# EAGLE design LB_BIT_i18_MOTIONTRIGGER-v03(rev1) (EAGLE 6.6.0)
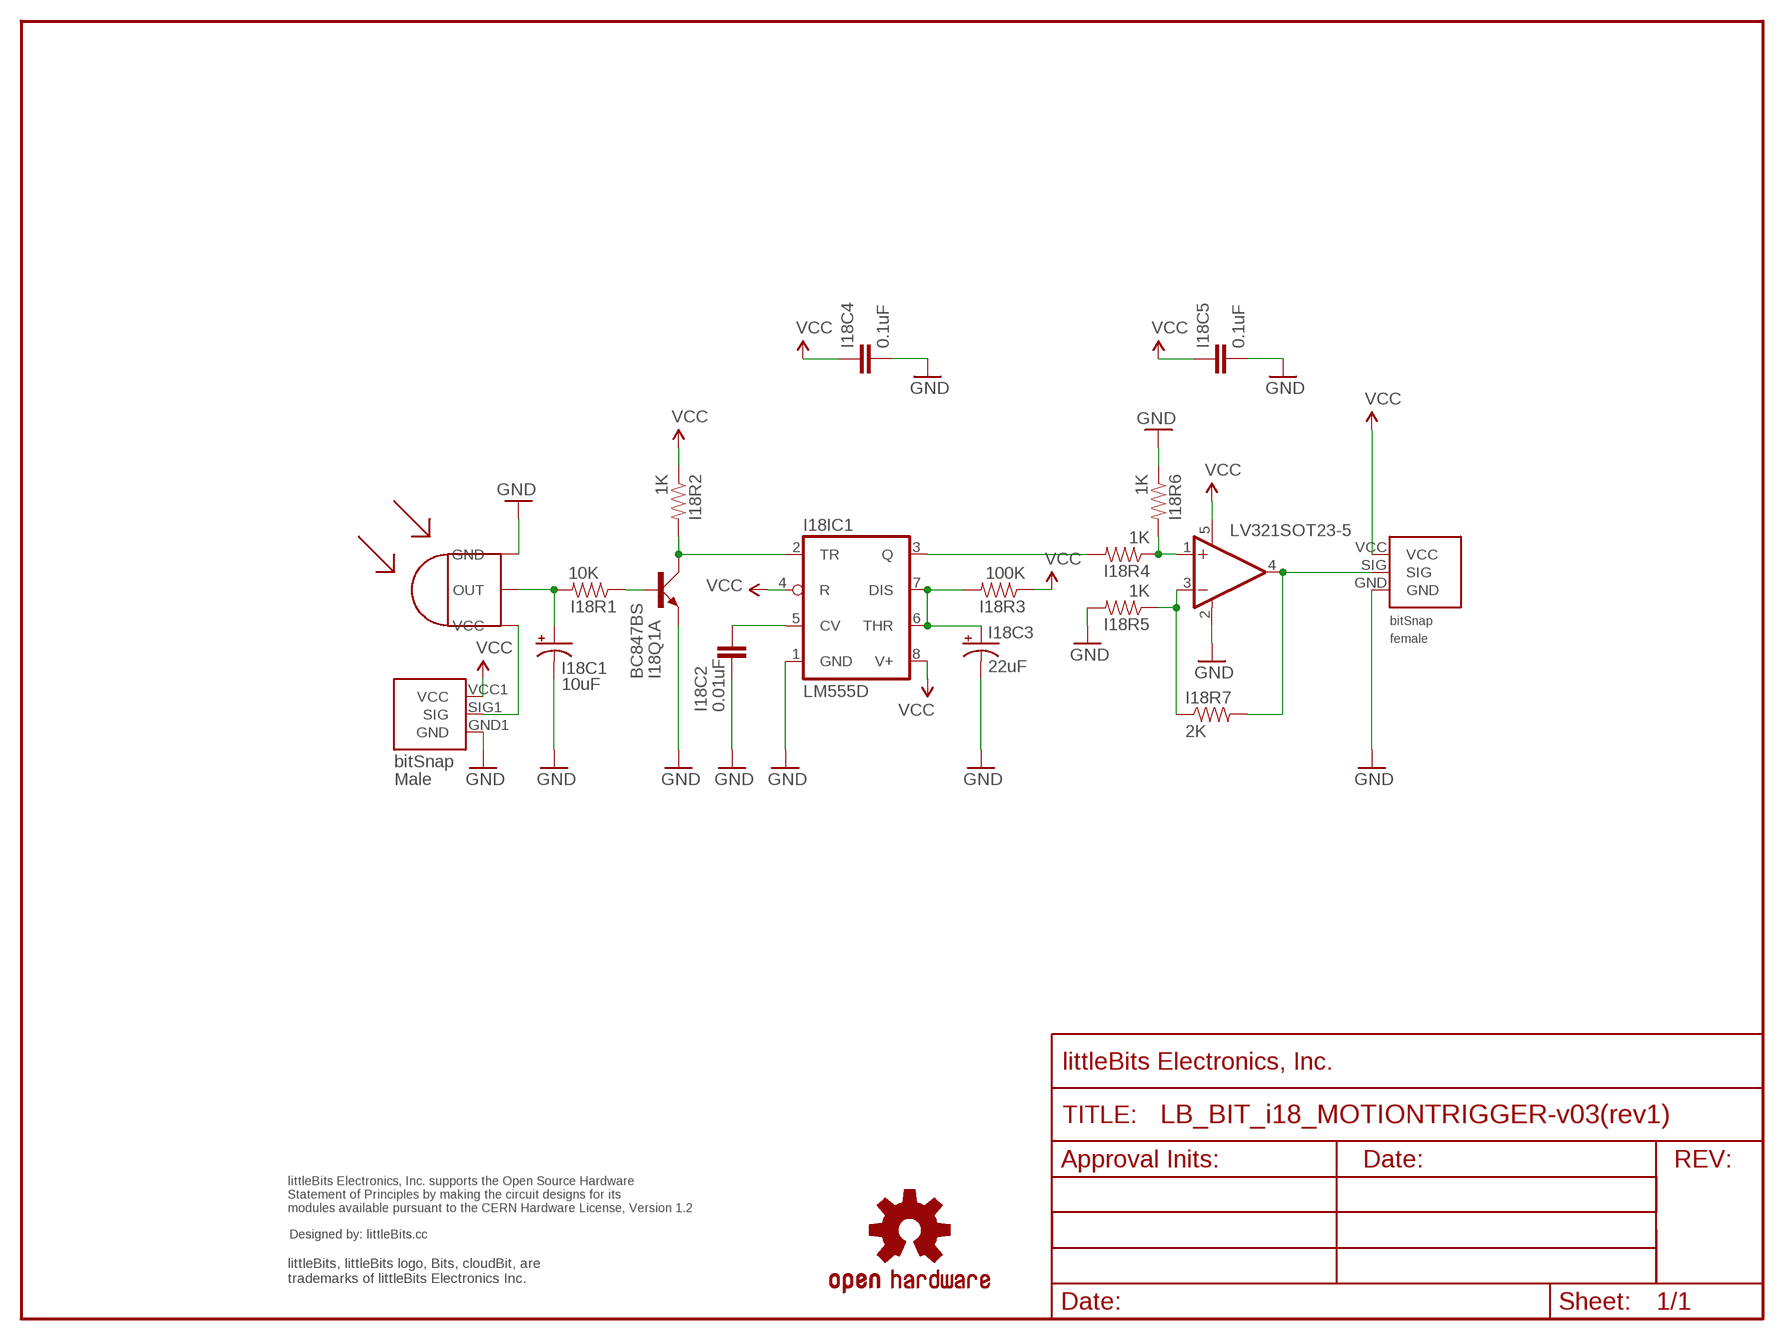
[diagram p0: schematic, sheet 1]

## Parts
I18BSF  BITSNAP_V03_FEMALE  [BITSNAP_V03_FEMALE]
I18BSM  BITSNAP_V03_MALE  [BITSNAP_V03_MALE]
I18C1  10uF  CAP_POL1206  [EIA3216]
I18C2  0.01uF  CAP0603-CAP  [0603-CAP]
I18C3  22uF  CAP_POL1206  [EIA3216]
I18C4  0.1uF  CAP0603-CAP  [0603-CAP]
I18C5  0.1uF  CAP0603-CAP  [0603-CAP]
I18IC1  LM555D  [SO08]
I18Q1  BC847BS  [SOT363_PHILIPS]
I18R1  10K  RESISTOR0603-RES  [0603-RES]
I18R2  1K  RESISTOR0603-RES  [0603-RES]
I18R3  100K  RESISTOR0603-RES  [0603-RES]
I18R4  1K  RESISTOR0603-RES  [0603-RES]
I18R5  1K  RESISTOR0603-RES  [0603-RES]
I18R6  1K  RESISTOR0603-RES  [0603-RES]
I18R7  2K  RESISTOR0603-RES  [0603-RES]
I18U1  PIR-EKMC1601112  [PIR-EKMC1601112]
I18U2  LV321SOT23-5  [SOT23-5]
U$1  OSHWCREDIT  [OSHWCREDIT]
U$2  FRAME-LETTER-OHWOHW  [FABDWG01-OHW]
U$8  OSHW-LOGOL  [OSHW-LOGO-L]

## Nets
GND: I18BSF.GND I18BSM.GND1(GND) I18C1.C(-) I18C2.2 I18C3.C(-) I18C4.2 I18C5.2 I18IC1.1(GND) I18Q1.1(A:E) I18R5.2 I18R6.1 I18U1.GND I18U2.2(V-)
N$1: I18BSM.SIG1(SIG) I18U1.VCC
N$2: I18IC1.2(TR) I18Q1.6(A:C) I18R2.2
N$3: I18C1.A(+) I18R1.2 I18U1.OUT
N$4: I18Q1.2(A:B) I18R1.1
N$5: I18C2.1 I18IC1.5(CV)
N$6: I18C3.A(+) I18IC1.6(THR) I18IC1.7(DIS) I18R3.2
N$7: I18IC1.3(Q) I18R4.2
N$8: I18R4.1 I18R6.2 I18U2.1(+IN)
N$9: I18R5.1 I18R7.1 I18U2.3(-IN)
N$10: I18BSF.SIG I18R7.2 I18U2.4(OUT)
VCC: I18BSF.VCC I18BSM.VCC1(VCC) I18C4.1 I18C5.1 I18IC1.4(R) I18IC1.8(V+) I18R2.1 I18R3.1 I18U2.5(V+)
Unconnected: I18Q1.3(B:C) I18Q1.4(B:E) I18Q1.5(B:B)

## Library data of the parts
I18BSF = bitSnap:BITSNAP_V03_FEMALE
I18BSM = bitSnap:BITSNAP_V03_MALE
I18C1 I18C3 = SparkFun:CAP_POL: Capacitor Polarized These are standard SMD and PTH capacitors. Normally 10uF, 47uF, and 100uF in electrolytic and tantalum varieties. Always verify the external diameter of the through hole cap, it varies with capacity, voltage, and manufacturer. The EIA devices should be standard.
I18C2 I18C4 I18C5 = SparkFun:CAP: Capacitor Standard 0603 ceramic capacitor, and 0.1" leaded capacitor.
I18IC1 = linear:*555: TIMER
I18Q1 = transistor-small-signal:BC847BS: NPN general purpose double transistor Source: http://www.farnell.com/datasheets/2466.pdf
I18R1-I18R7 = SparkFun:RESISTOR: Resistor Basic schematic elements and footprints for 0603, 1206, and PTH 1/10th watt (small) resistors.
I18U1 = LITTLEBITS:PIR-EKMC1601112
I18U2 = LITTLEBITS:LV321
U$1 = LITTLEBITS:OSHWCREDIT
U$2 = LITTLEBITS:FRAME-LETTER-OHW
U$8 = SparkFun_NEW:OSHW-LOGO: Open Source Hardware Logo This logo indicates the piece of hardware it is found on incorporates a OSHW license and/or adheres to the definition of open source hardware found here: http://freedomdefined.org/OSHW

## Board
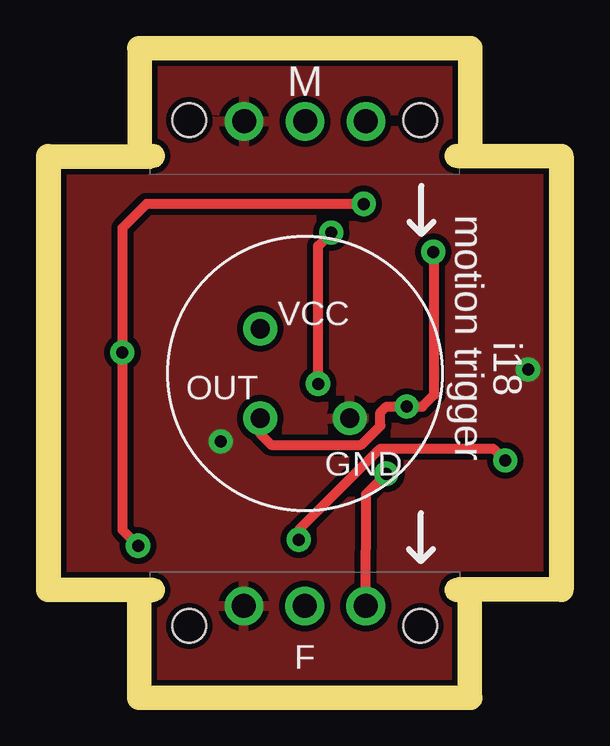
[diagram p1: board, top side]
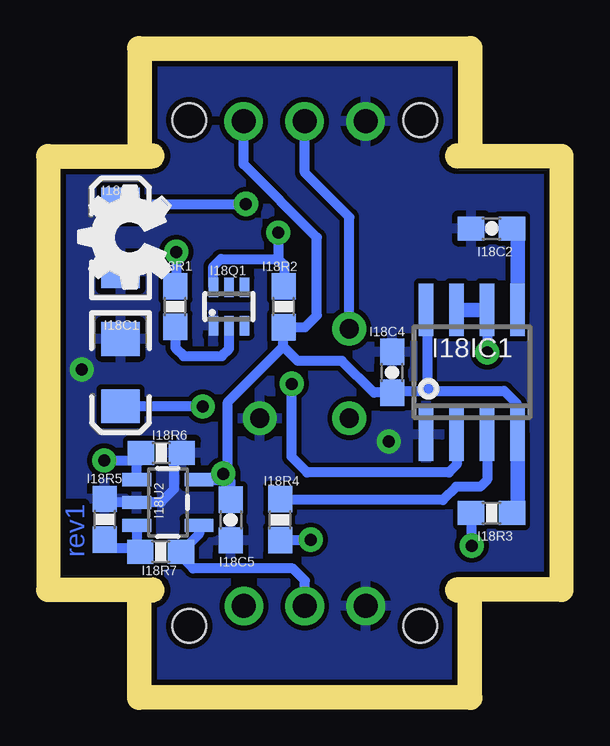
[diagram p2: board, bottom side, seen from below]

Size 20.4 x 26.1 mm. Coordinates in mm from the lower left corner, seen from the top.
Outline: 0,21.6 0,4.5
Outline: 20.4,4.5 20.4,21.6
Copper layers (1*16): Top 0.035mm / dielectric 1.5mm / Bottom 0.035mm
Design rules "default": minimum track width 8mil, minimum drill 20mil, track to track 8mil, track to pad 8mil, pad to pad 8mil, via to via 8mil, smd to smd 8mil, copper to edge 10mil, drill to drill 8mil, minimum pad ring 12mil, minimum via ring 10mil, stop-mask expansion 4mil, vias tented up to drill 25mil, thermal gap 10mil
Milling: 2 lines

### Footprints (pad centres in the part's own frame; a part is rotated, then mirrored left to right if it is on the bottom)
BITSNAP_V03_FEMALE = drill 1: GND 3.91,3.33; SIG 6.45,3.33; VCC 8.99,3.33 | hole 1.4: 1.63,2.5; 11.27,2.5
BITSNAP_V03_MALE = drill 1: GND1 8.98,2.56; SIG1 6.44,2.56; VCC1 3.9,2.56 | hole 1.4: 11.27,2.5; 1.63,2.5
EIA3216 = smd 1.4 x 1.6: A 1.4,0; C -1.4,0
0603-CAP = smd 1.1 x 1: 1 -0.85,0; 2 0.85,0
SO08 = smd 0.6 x 2.2: 1 -1.905,-2.6; 2 -0.635,-2.6; 3 0.635,-2.6; 4 1.905,-2.6; 5 1.905,2.6; 6 0.635,2.6; 7 -0.635,2.6; 8 -1.905,2.6
SOT363_PHILIPS = smd 0.4 x 0.8: 1 -0.65,-0.8; 2 0,-0.8; 3 0.65,-0.8; 4 0.65,0.8; 5 0,0.8; 6 -0.65,0.8
0603-RES = smd 1.1 x 1: 1 -0.85,0; 2 0.85,0
PIR-EKMC1601112 = drill 0.8: GND 1.865,-1.865; OUT -1.865,-1.865; VCC -1.865,1.865
SOT23-5 = smd 0.55 x 1.2: 1 -0.95,-1.3; 2 0,-1.3; 3 0.95,-1.3; 4 0.95,1.3; 5 -0.95,1.3

### Placement (x,y rotation side)
I18BSF  3.75,0 0 top
I18BSM  16.65,26.1 180 top
I18C1  17.88,13.06 270 bottom
I18C2  2.42,19.07 180 bottom
I18C3  17.88,18.68 90 bottom
I18C4  6.56,13.08 90 bottom
I18C5  13.29,6.92 270 bottom
I18IC1  3.24,13.08 0 bottom
I18Q1  13.36,15.82 0 bottom
I18R1  15.59,15.82 90 bottom
I18R2  11.08,15.81 90 bottom
I18R3  2.42,7.21 180 bottom
I18R4  11.23,6.93 90 bottom
I18R5  18.53,6.95 90 bottom
I18R6  16.18,9.72 180 bottom
I18R7  16.21,5.59 0 bottom
I18U1  10.21,13.03 0 top
I18U2  15.91,7.65 270 bottom
U$1  -94.3,-64.7 0 top  (outside the outline)
U$2  0,0 0 top
U$7  [OSHW_FILLX150_NOTEXT]  15.81,15.76 0 top
U$8  -32.8,-69.56 0 top  (outside the outline)

### Tracks (layer width: path | path; a pad name or v marks a point on that pad's centre or on a via)
GND  (via drill 0.5)
  Bottom 0.406: I18R5.2 18.38,7.65 I18U2.2 16.2,7.65 15.65,8.2 15.65,9.45 15.38,9.72 I18R6.1
  other vias: 6.7,10.2 19.5,13.2
  pour Top (isolate 0.254): 0.22,25.85 20.15,25.85 20.15,0.22 0.22,0.22
  pour Bottom: 0.22,25.85 20.15,25.85 20.15,0.22 0.22,0.22
N$1
  Bottom 0.406: I18U1.VCC 8.35,19.55 10.2,21.4 I18BSM.SIG1
N$2  (via drill 0.5)
  Top 0.406: v10.75,12.6 10.75,18.35 v11.3,18.9
  Bottom 0.406: I18Q1.6 14.01,17.49 13.7,17.8 11.3,17.8 | 11.3,17.8 11.05,17.55 11.05,16.69 I18R2.2 | I18IC1.2 3.87,9.23 4.2,8.9 10.1,8.9 10.75,9.55 v10.75,12.6 | v11.3,18.9 11.3,17.8
N$3  (via drill 0.5)
  Top 0.406: I18U1.OUT 8.35,10.51 8.8,10.05 12.55,10.05 13.35,10.85 13.35,11.4 13.6,11.65 v14.45,11.65 15.1,11.65 15.6,12.15 15.6,18.05 v15.55,18.1
  Bottom 0.406: v14.45,11.65 17.86,11.65 I18C1.A | v15.55,18.1 15.55,16.71 I18R1.2
N$4
  Bottom 0.406: I18R1.1 15.59,14.09 15.25,13.75 13.65,13.75 13.35,14.05 13.36,14.06 I18Q1.2
N$5
  Bottom 0.61: I18IC1.5 1.33,18.59 I18C2.1
N$6  (via drill 0.5)
  Top 0.406: v3.25,5.85 2.6,6.5 v2.6,13.9 2.6,19.1 3.6,20.1 v12.65,20.1
  Bottom 0.406: I18IC1.6 v2.6,13.9 | v3.25,5.85 3.25,7.19 I18R3.2 | I18C3.A 12.67,20.08 v12.65,20.1
  Bottom 0.61: I18IC1.6 I18IC1.7
N$7
  Bottom 0.406: I18IC1.3 2.6,8.6 2.9,8.3 3.9,8.3 4.45,7.75 11.15,7.75 I18R4.2
N$8  (via drill 0.5)
  Top 0.406: v9.95,6.1 9.95,6.5 13.35,9.9 18.05,9.9 v18.55,9.4
  Bottom 0.406: 17.03,9.41 I18R6.2 | I18R4.1 10.52,6.08 v9.95,6.1 | v18.55,9.4 17.05,9.4 I18R6.2 | I18U2.1 17.21,9.54 I18R6.2
N$9
  Bottom 0.406: 18.32,5.89 I18R5.1 18.18,5.75 17.21,5.75 | I18U2.3 17.21,5.75 | 17.21,5.75 I18R7.1
N$10
  Bottom 0.406: I18BSF.SIG 10.2,4.4 10.7,4.9 14.85,4.9 15.35,5.4 15.35,5.89 I18R7.2 14.61,6.34 I18U2.4
VCC  (via drill 0.5)
  Top 0.406: I18BSF.VCC 12.75,8 v13.6,8.85
  Bottom 0.406: I18C4.1 6.37,12.33 | I18IC1.8 5.1,15.64 5.1,12.35 5.15,12.3 | 5.15,12.3 6.49,12.3 I18C4.1 | 5.15,12.3 1.9,12.3 1.35,11.75 1.35,10.5 I18IC1.4 | I18C4.1 7.33,12.23 8.65,13.55 10.5,13.55 11.1,14.15 | 11.1,14.15 11.1,14.94 I18R2.1 10.19,14.96 9.7,15.45 9.7,18.7 12.75,21.75 I18BSM.VCC1 | v13.6,8.85 13.4,9.05 13.4,11.85 11.1,14.15 | I18U2.5 13.6,8.6 v13.6,8.85 | I18C5.1 13.29,8.54 v13.6,8.85
  Bottom 0.61: I18IC1.4 1.33,7.7 I18R3.1

### Text on the board
Bottom: rev1
tPlace: motion trigger | i18
Milling: 1mm DIA. ROUTER PATH
Reference: MEDIUM